# Altium project SMG_Clock_Project.PrjPcb
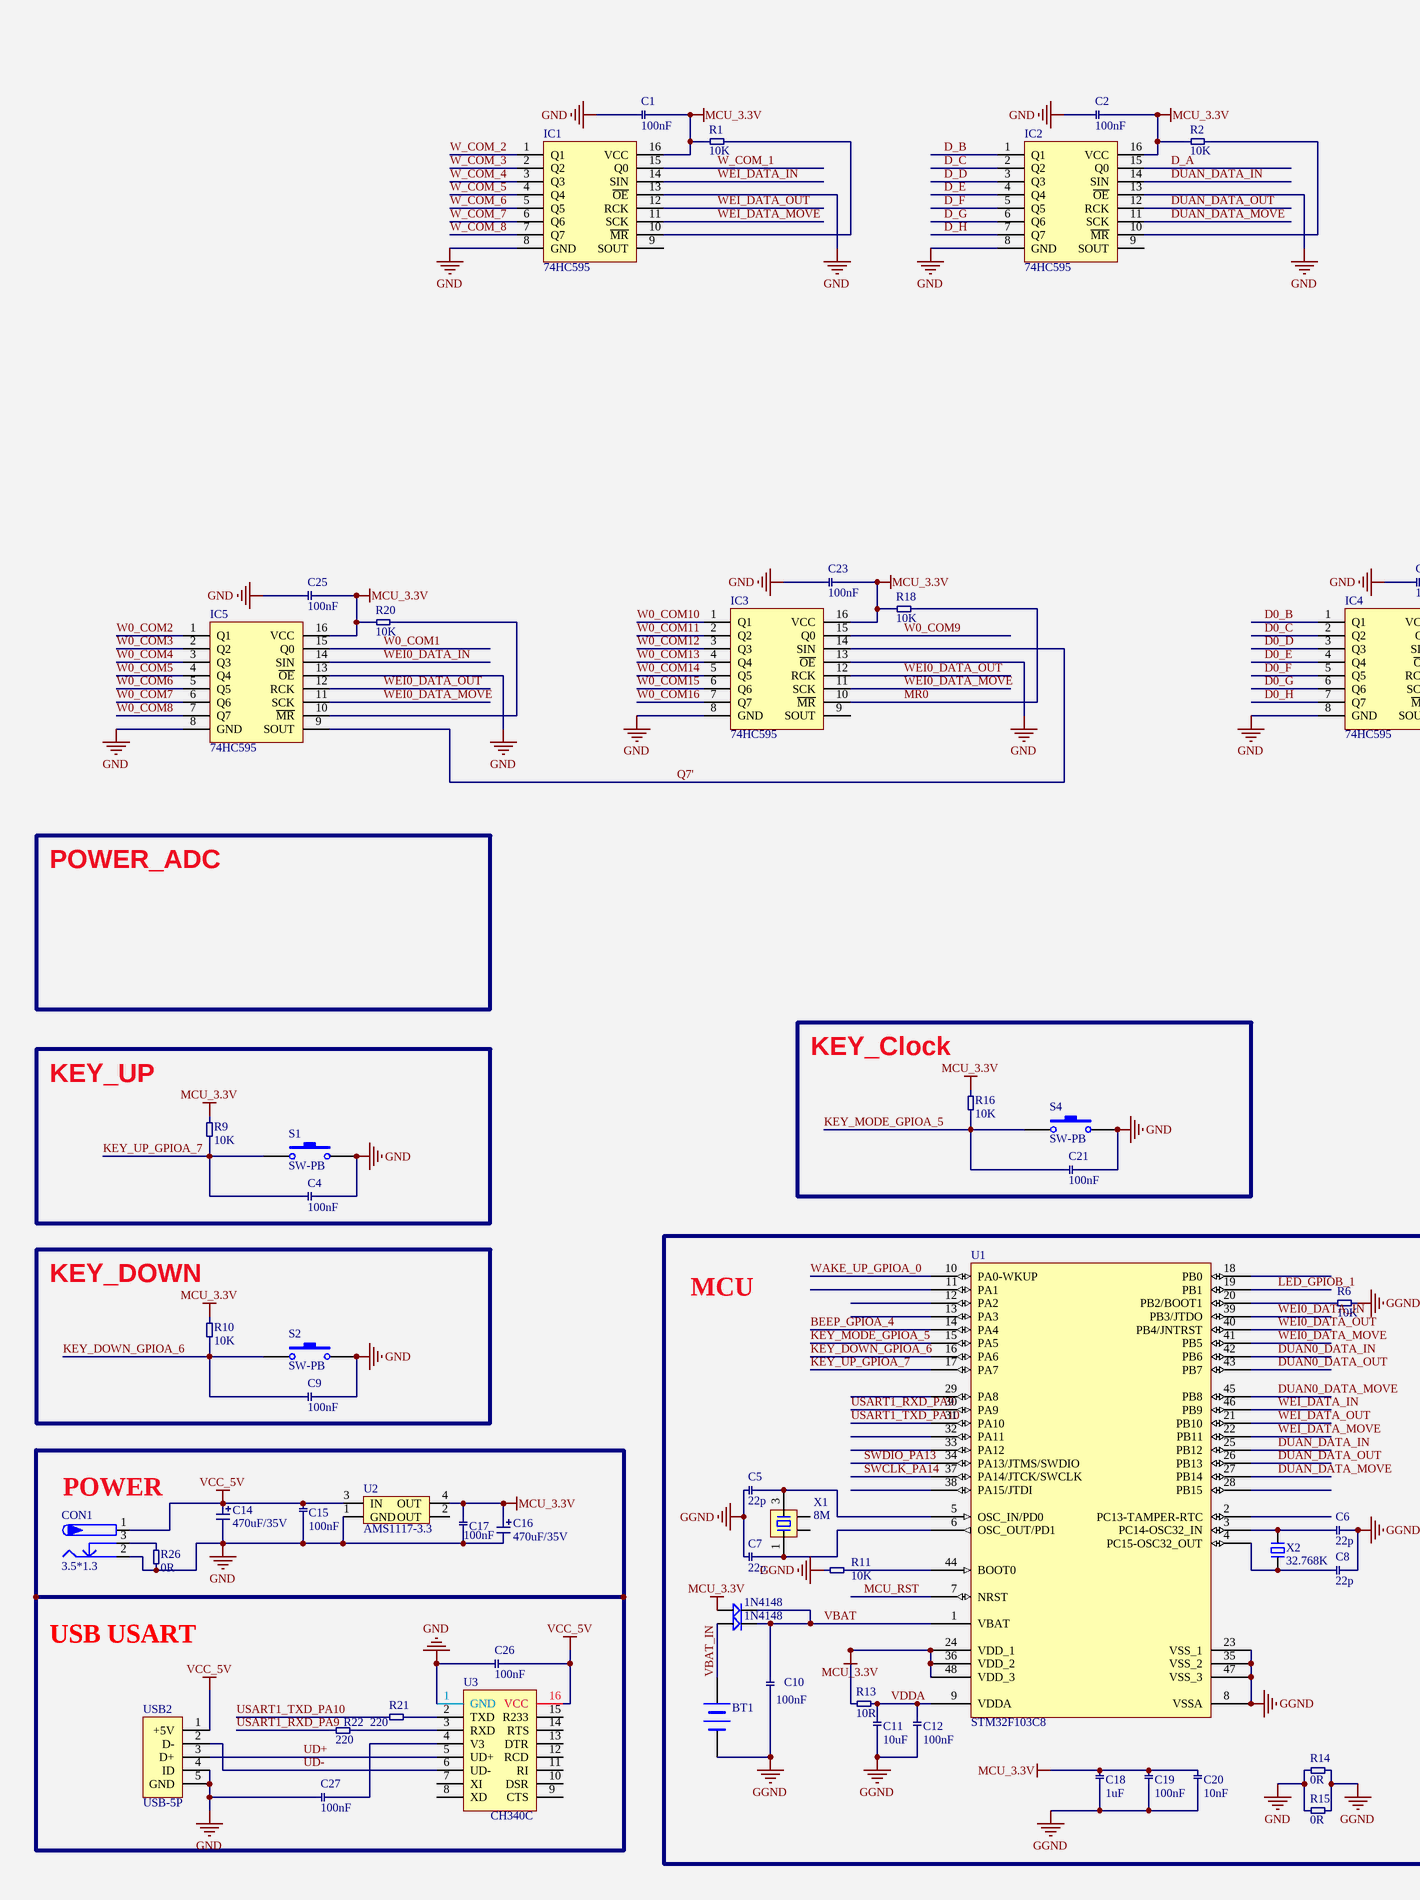
[diagram p0: Clock.SchDoc, left]
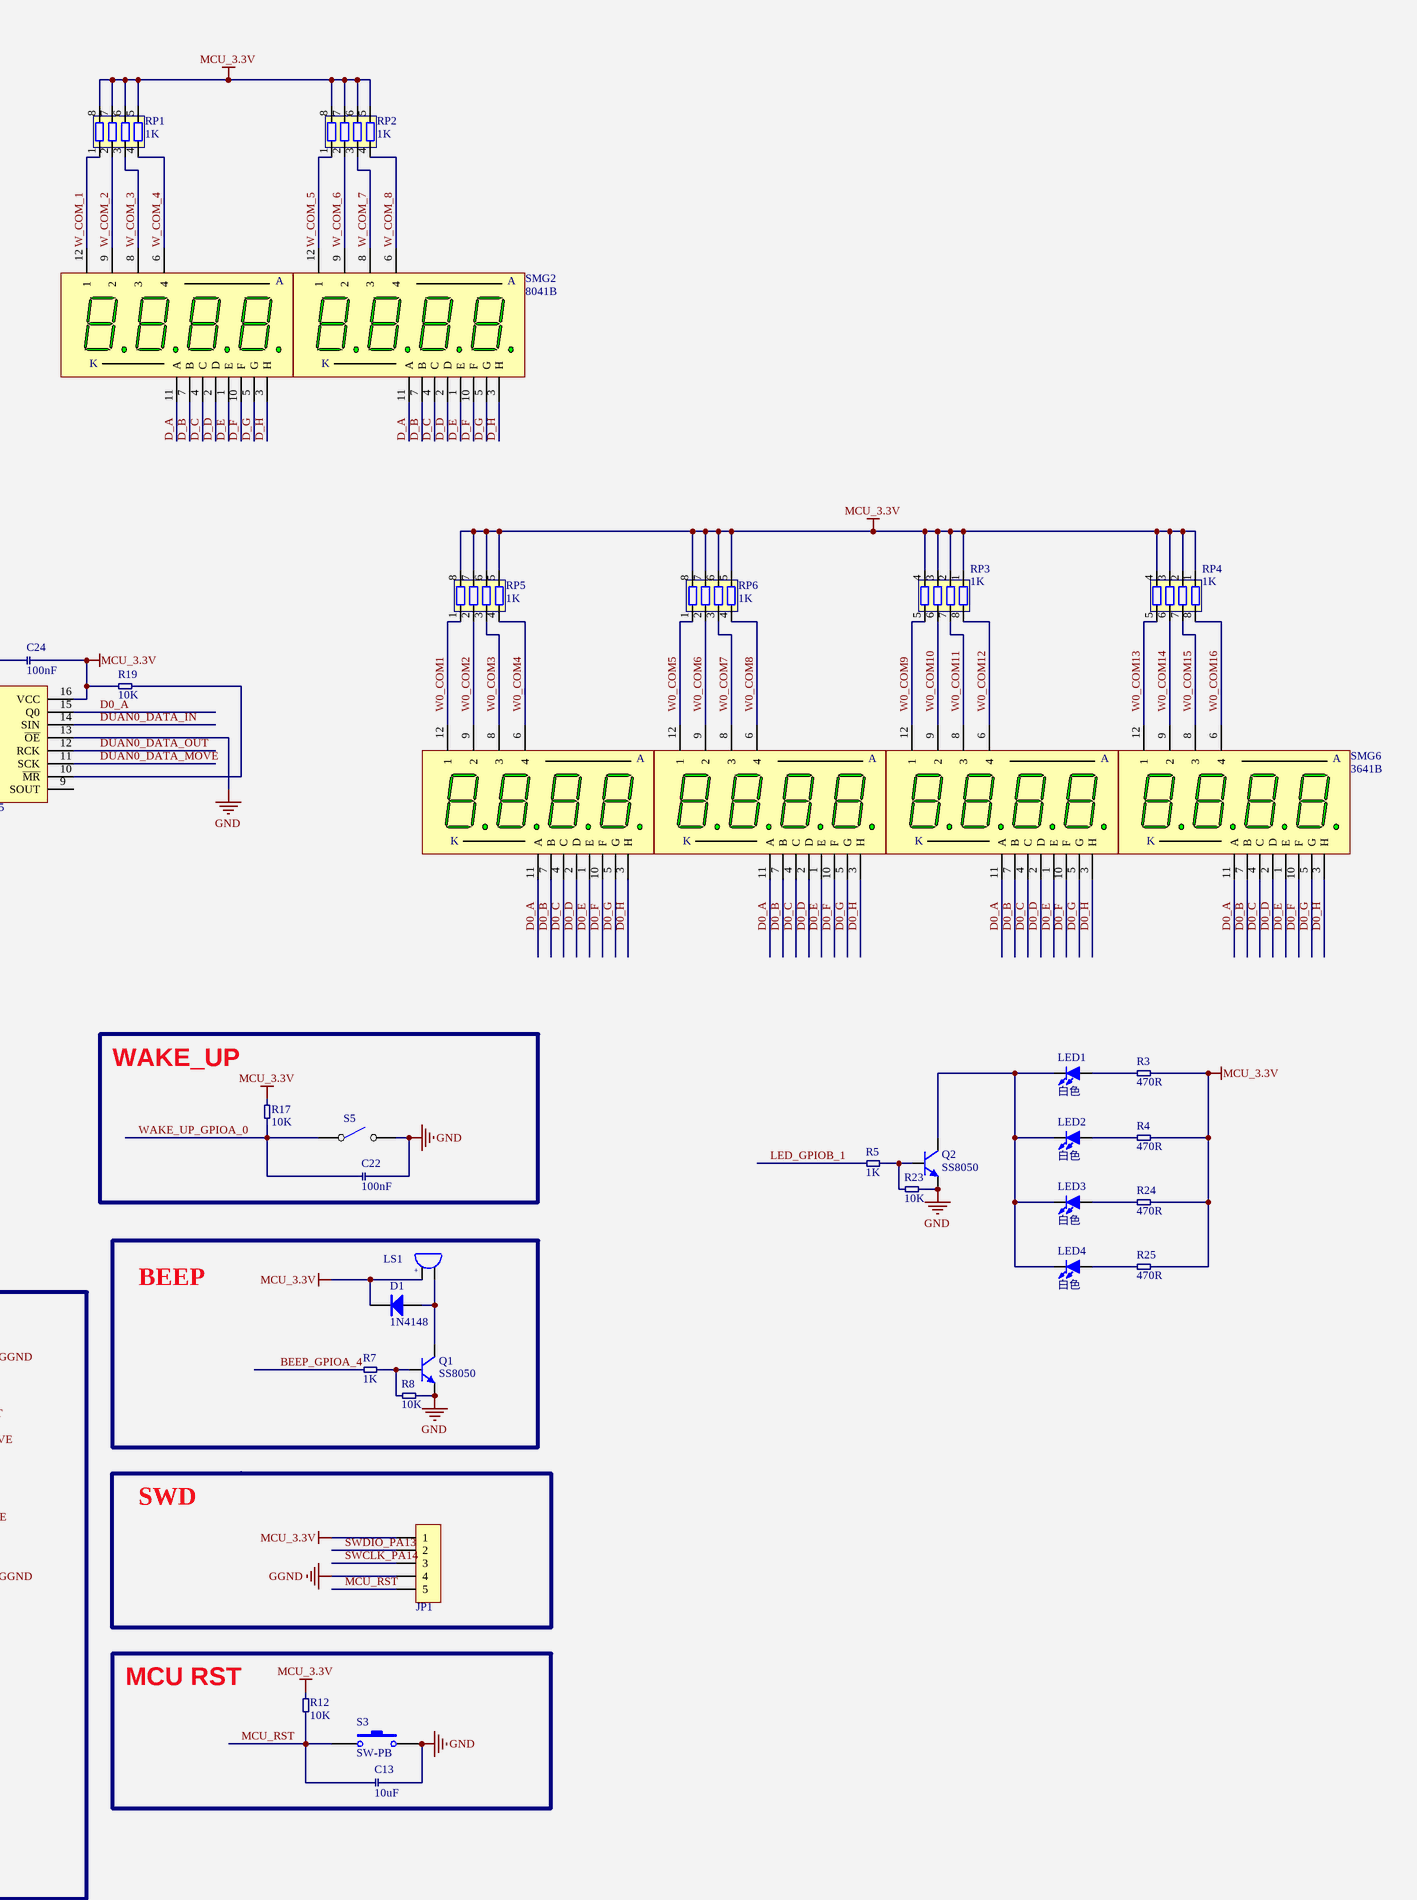
[diagram p1: Clock.SchDoc, right]
1 sheet, 93 parts. Net scope: global (net labels, ports and power ports of the same name join across sheets).
Board file: Clock_Board.PcbDoc

## Sheet Clock.SchDoc
size A2

### Parts
BT1  BATTERY  [VBAT]  (value not drawn)
C1  100nF  [0603CC]
C2  100nF  [0603CC]
C4  100nF  [0603CC]
C5  22p  [0603CC]
C6  22p  [0603CC]
C7  22p  [0603CC]
C8  22p  [0603CC]
C9  100nF  [0603CC]
C10  100nF  [0603CC]
C11  10uF  [0603CC]
C12  100nF  [0603CC]
C13  10uF  [0603CC]
C14  470uF/35V  [CD A(3216)]
C15  100nF  [0603CC]
C16  470uF/35V  [C3216]
C17  100nF  [0603CC]
C18  1uF  [0603CC]
C19  100nF  [0603CC]
C20  10nF  [0603CC]
C21  100nF  [0603CC]
C22  100nF  [0603CC]
C23  100nF  [0603CC]
C24  100nF  [0603CC]
C25  100nF  [0603CC]
C26  100nF  [0603CC]
C27  100nF  [0603CC]
CON1  3.5*1.3  [DC-012]
D1  1N4148  [SOD-323]
D2  1N4148  [SOD-323]
D4  1N4148  [SOD-323]
IC1  74HC595  [SOP16_N]
IC2  74HC595  [SOP16_N]
IC3  74HC595  [SOP16_N]
IC4  74HC595  [SOP16_N]
IC5  74HC595  [SOP16_N]
JP1  HDR-1X5  [HDR2.54-LI-5P]  (value not drawn)
LED1  白色  [LED 5MM-W]
LED2  白色  [LED 5MM-W]
LED3  白色  [LED 5MM-W]
LED4  白色  [LED 5MM-W]
LS1  DC5V  [BEEP 5x9x5.5]  (value not drawn)
Q1  SS8050  [SOT23-3N]
Q2  SS8050  [SOT23-3N]
R1  10K  [0603RR]
R2  10K  [0603RR]
R3  470R  [0603RR]
R4  470R  [0603RR]
R5  1K  [0603RR]
R6  10K  [0603RR]
R7  1K  [0603RR]
R8  10K  [0603RR]
R9  10K  [0603RR]
R10  10K  [0603RR]
R11  10K  [0603RR]
R12  10K  [0603RR]
R13  10R  [0603RR]
R14  0R  [0603RR]
R15  0R  [0603RR]
R16  10K  [0603RR]
R17  10K  [0603RR]
R18  10K  [0603RR]
R19  10K  [0603RR]
R20  10K  [0603RR]
R21  220  [0603RR]
R22  220  [0603RR]
R23  10K  [0603RR]
R24  470R  [0603RR]
R25  470R  [0603RR]
R26  0R  [0603RR]
RP1  1K  [RCA-8P4R-0603]
RP2  1K  [RCA-8P4R-0603]
RP3  1K  [RCA-8P4R-0603]
RP4  1K  [RCA-8P4R-0603]
RP5  1K  [RCA-8P4R-0603]
RP6  1K  [RCA-8P4R-0603]
S1  SW-PB  [TSW DIP-6*6*6_V]
S2  SW-PB  [TSW DIP-6*6*6_V]
S3  SW-PB  [TSW DIP-6*6*6_V]
S4  SW-PB  [TSW DIP-6*6*6_V]
S5  单刀开关  [CAP 2.5*5*11-H]  (value not drawn)
SMG1  8041B  [SMG 0.8-4P]
SMG2  8041B  [SMG 0.8-4P]
SMG3  3641B  [SMG 0.36-4P]
SMG4  3641B  [SMG 0.36-4P]
SMG5  3641B  [SMG 0.36-4P]
SMG6  3641B  [SMG 0.36-4P]
U1  STM32F103C8  [LQFP48 7X7_M]
U2  AMS1117-3.3  [SOT223_N]
U3  CH340C  [SOP16_L]
USB2  USB-5P  [USB-MICRO_C]
X1  8M  [OSC 3225-4P]
X2  32.768K  [OSC 3215-2P]

### Nets
GGND: BT1.2(-) C5.1 C6.2 C7.1 C8.2 C10.1 C11.1 C12.1 C18.1 C19.1 C20.1 JP1.4 R6.2 R11.1 R14.2 R15.2 U1.8(VSSA) U1.23(VSS_1) U1.35(VSS_2) U1.47(VSS_3)
GND: C1.2 C2.2 C4.2 C9.2 C13.1 C14.2 C15.1 C16.2 C17.1 C21.2 C22.2 C23.2 C24.2 C25.2 C26.2 C27.2 CON1.2 IC1.8(GND) IC1.13(~{OE}) IC2.8(GND) IC2.13(~{OE}) IC3.8(GND) IC3.13(~{OE}) IC4.8(GND) IC4.13(~{OE}) IC5.8(GND) IC5.13(~{OE}) Q1.2(E) Q2.2(E) R8.2 R14.1 R15.1 R23.2 R26.2 S1.2 S2.2 S3.2 S4.2 S5.2 U2.1(GND) U3.1(GND) USB2.4(ID) USB2.5(GND)
MCU_3.3V: C1.1 C2.1 C16.1 C17.2 C18.2 C19.2 C20.2 C23.1 C24.1 C25.1 D1.2(K) D4.1 IC1.16(VCC) IC2.16(VCC) IC3.16(VCC) IC4.16(VCC) IC5.16(VCC) JP1.1 LS1.1 R1.2 R2.2 R3.2 R4.2 R9.2 R10.2 R12.2 R13.1 R16.2 R17.2 R18.2 R19.2 R20.2 R24.2 R25.2 RP1.5 RP1.6 RP1.7 RP1.8 RP2.5 RP2.6 RP2.7 RP2.8 RP3.1 RP3.2 RP3.3 RP3.4 RP4.1 RP4.2 RP4.3 RP4.4 RP5.5 RP5.6 RP5.7 RP5.8 RP6.5 RP6.6 RP6.7 RP6.8 U1.24(VDD_1) U1.36(VDD_2) U1.48(VDD_3) U2.4(OUT)
VCC_5V: C14.1 C15.2 C26.1 CON1.1 U2.3(IN) U3.16(VCC) USB2.1(+5V)
BEEP_GPIOA_4: R7.1 U1.14(PA4)
D0_A: IC4.15(Q0) SMG3.11(A) SMG4.11(A) SMG5.11(A) SMG6.11(A)
D0_B: IC4.1(Q1) SMG3.7(B) SMG4.7(B) SMG5.7(B) SMG6.7(B)
D0_C: IC4.2(Q2) SMG3.4(C) SMG4.4(C) SMG5.4(C) SMG6.4(C)
D0_D: IC4.3(Q3) SMG3.2(D) SMG4.2(D) SMG5.2(D) SMG6.2(D)
D0_E: IC4.4(Q4) SMG3.1(E) SMG4.1(E) SMG5.1(E) SMG6.1(E)
D0_F: IC4.5(Q5) SMG3.10(F) SMG4.10(F) SMG5.10(F) SMG6.10(F)
D0_G: IC4.6(Q6) SMG3.5(G) SMG4.5(G) SMG5.5(G) SMG6.5(G)
D0_H: IC4.7(Q7) SMG3.3(H) SMG4.3(H) SMG5.3(H) SMG6.3(H)
D_A: IC2.15(Q0) SMG1.11(A) SMG2.11(A)
D_B: IC2.1(Q1) SMG1.7(B) SMG2.7(B)
D_C: IC2.2(Q2) SMG1.4(C) SMG2.4(C)
D_D: IC2.3(Q3) SMG1.2(D) SMG2.2(D)
D_E: IC2.4(Q4) SMG1.1(E) SMG2.1(E)
D_F: IC2.5(Q5) SMG1.10(F) SMG2.10(F)
D_G: IC2.6(Q6) SMG1.5(G) SMG2.5(G)
D_H: IC2.7(Q7) SMG1.3(H) SMG2.3(H)
DUAN0_DATA_IN: IC4.14(SIN) U1.42(PB6)
DUAN0_DATA_MOVE: IC4.11(SCK) U1.45(PB8)
DUAN0_DATA_OUT: IC4.12(RCK) U1.43(PB7)
DUAN_DATA_IN: IC2.14(SIN) U1.25(PB12)
DUAN_DATA_MOVE: IC2.11(SCK) U1.27(PB14)
DUAN_DATA_OUT: IC2.12(RCK) U1.26(PB13)
KEY_DOWN_GPIOA_6: C9.1 R10.1 S2.1 U1.16(PA6)
KEY_MODE_GPIOA_5: C21.1 R16.1 S4.1 U1.15(PA5)
KEY_UP_GPIOA_7: C4.1 R9.1 S1.1 U1.17(PA7)
LED_GPIOB_1: R5.1 U1.19(PB1)
MCU_RST: C13.2 JP1.5 R12.1 S3.1 U1.7(NRST)
MR0: IC3.10(~{MR}) R18.1
Q7': IC3.14(SIN) IC5.9(SOUT)
SWCLK_PA14: JP1.3 U1.37(PA14/JTCK/SWCLK)
SWDIO_PA13: JP1.2 U1.34(PA13/JTMS/SWDIO)
UD+: U3.5(UD+) USB2.3(D+)
UD-: U3.6(UD-) USB2.2(D-)
USART1_RXD_PA9: R22.1 U1.30(PA9)
USART1_TXD_PA10: R21.1 U1.31(PA10)
VBAT: C10.2 D2.2 D4.2 U1.1(VBAT)
VBAT_IN: BT1.1(+) D2.1
VDDA: C11.2 C12.2 R13.2 U1.9(VDDA)
W0_COM1: IC5.15(Q0) RP5.1 SMG3.12(1)
W0_COM2: IC5.1(Q1) RP5.2 SMG3.9(2)
W0_COM3: IC5.2(Q2) RP5.3 SMG3.8(3)
W0_COM4: IC5.3(Q3) RP5.4 SMG3.6(4)
W0_COM5: IC5.4(Q4) RP6.1 SMG4.12(1)
W0_COM6: IC5.5(Q5) RP6.2 SMG4.9(2)
W0_COM7: IC5.6(Q6) RP6.3 SMG4.8(3)
W0_COM8: IC5.7(Q7) RP6.4 SMG4.6(4)
W0_COM9: IC3.15(Q0) RP3.5 SMG5.12(1)
W0_COM10: IC3.1(Q1) RP3.6 SMG5.9(2)
W0_COM11: IC3.2(Q2) RP3.7 SMG5.8(3)
W0_COM12: IC3.3(Q3) RP3.8 SMG5.6(4)
W0_COM13: IC3.4(Q4) RP4.5 SMG6.12(1)
W0_COM14: IC3.5(Q5) RP4.6 SMG6.9(2)
W0_COM15: IC3.6(Q6) RP4.7 SMG6.8(3)
W0_COM16: IC3.7(Q7) RP4.8 SMG6.6(4)
W_COM_1: IC1.15(Q0) RP1.1 SMG1.12(1)
W_COM_2: IC1.1(Q1) RP1.2 SMG1.9(2)
W_COM_3: IC1.2(Q2) RP1.3 SMG1.8(3)
W_COM_4: IC1.3(Q3) RP1.4 SMG1.6(4)
W_COM_5: IC1.4(Q4) RP2.1 SMG2.12(1)
W_COM_6: IC1.5(Q5) RP2.2 SMG2.9(2)
W_COM_7: IC1.6(Q6) RP2.3 SMG2.8(3)
W_COM_8: IC1.7(Q7) RP2.4 SMG2.6(4)
WAKE_UP_GPIOA_0: C22.1 R17.1 S5.1 U1.10(PA0-WKUP)
WEI0_DATA_IN: IC5.14(SIN) U1.39(PB3/JTDO)
WEI0_DATA_MOVE: IC3.11(SCK) IC5.11(SCK) U1.41(PB5)
WEI0_DATA_OUT: IC3.12(RCK) IC5.12(RCK) U1.40(PB4/JNTRST)
WEI_DATA_IN: IC1.14(SIN) U1.46(PB9)
WEI_DATA_MOVE: IC1.11(SCK) U1.22(PB11)
WEI_DATA_OUT: IC1.12(RCK) U1.21(PB10)
NetC5_2: C5.2 U1.5(OSC_IN/PD0) X1.3
NetC6_1: C6.1 U1.3(PC14-OSC32_IN) X2.2
NetC7_2: C7.2 U1.6(OSC_OUT/PD1) X1.1
NetC8_1: C8.1 U1.4(PC15-OSC32_OUT) X2.1
NetC27_1: C27.1 U3.4(V3)
NetCON1_3: CON1.3 R26.1
NetD1_1: D1.1(A) LS1.2 Q1.3(C)
NetIC1_10: IC1.10(~{MR}) R1.1
NetIC2_10: IC2.10(~{MR}) R2.1
NetIC4_10: IC4.10(~{MR}) R19.1
NetIC5_10: IC5.10(~{MR}) R20.1
NetLED1_1: LED1.1(A) R3.1
NetLED1_2: LED1.2(K) LED2.2(K) LED3.2(K) LED4.2(K) Q2.3(C)
NetLED2_1: LED2.1(A) R4.1
NetLED3_1: LED3.1(A) R24.1
NetLED4_1: LED4.1(A) R25.1
NetQ1_1: Q1.1(B) R7.2 R8.1
NetQ2_1: Q2.1(B) R5.2 R23.1
NetR6_1: R6.1 U1.20(PB2/BOOT1)
NetR11_2: R11.2 U1.44(BOOT0)
NetR21_2: R21.2 U3.2(TXD)
NetR22_2: R22.2 U3.3(RXD)

Not connected (* = marked no-connect by the designer): IC1 9(SOUT); IC2 9(SOUT); IC3 9(SOUT); IC4 9(SOUT); U1 2(PC13-TAMPER-RTC) 11(PA1) 12(PA2) 13(PA3) 18(PB0) 28(PB15) 29(PA8) 32(PA11) 33(PA12) 38(PA15/JTDI); U2 2(OUT); U3 7(XI) 8(XD) 9(CTS) 10(DSR) 11(RI) 12(RCD) 13(DTR) 14(RTS) 15(R233); X1 2 4

### Notes on the sheet
- POWER_ADC
- WAKE_UP
- KEY_UP
- (near R16) KEY_Clock
- BEEP
- KEY_DOWN
- MCU
- (near CON1) POWER
- SWD
- USB USART
- MCU RST
- (in symbol 3641B) K
- (in symbol 8041B) K
- (in symbol BEEP) +

### Library data of the parts
C1 C2 C4-C13 C15 C17-C27 = cap
C14 C16 = Ecap
CON1 = P-DC: 低压电源接口; BOM名称: DC电源接口; 版权归属: 源创客; 学习资源: www.ooocke.com
D1 = 1N4148: 高速开关二极管; 版权归属: 源创客; BOM名称: 高速开关二极管; 学习资源: www.ooocke.com
D2 D4 = D
IC1-IC5 = 74HC595: 8位移位寄存器; 版权归属: 源创客; BOM名称: 8位移位寄存器; 学习资源: www.ooocke.com
JP1 = Header 5: 5P接插件; 版权归属: 源创客; BOM名称: 5P接插件; 学习资源: www.ooocke.com
LED1-LED4 = LED-5MM: 5mm插件LED; 版权归属: 源创客; BOM名称: 5mm插件LED; 学习资源: www.ooocke.com
LS1 = BEEP: 蜂鸣器; 版权归属: 源创客; BOM名称: 蜂鸣器; 学习资源: www.ooocke.com
Q1 Q2 = 8050-SMD: 高频放大-NPN型; 版权归属: 源创客; 属性: 40V 1.5A 1W 100MHZ; BOM名称: 高频放大-NPN型; 学习资源: www.ooocke.com
R1-R26 = res
RP1-RP6 = Resistor_Pack
S1-S4 = SW-PB: Switch; Published: 24-Mar-1999; LatestRevisionDate: 17-Jul-2002; LatestRevisionNote: Re-released for DXP Platform.; PackageReference: SPST-2; Publisher: Altium Limited
SMG1 SMG2 = 8041B: 0.8寸4位共阳数码管; 版权归属: 源创客; BOM名称: 0.8寸4位共阳; 学习资源: www.ooocke.com
SMG3-SMG6 = 3641B: 0.36寸4位共阳数码管; 版权归属: 源创客; BOM名称: 0.36寸4位共阳; 学习资源: www.ooocke.com
U1 = STM32F103C8: Flaah:64/RAM:20/IO:36; BOM名称: 32位STM单片机; 版权归属: 源创客; 学习资源: www.ooocke.com
U2 = AMS1117
USB2 = USB-5P: 微型USB母座; 版权归属: 源创客; BOM名称: 微型USB母座; 学习资源: www.ooocke.com
X1 = XTAL-4P: 4脚无源晶振; 版权归属: 源创客; BOM名称: 4脚无源晶振; 学习资源: www.ooocke.com
X2 = XTAL-2P: 2脚无源脚晶振; 版权归属: 源创客; BOM名称: 2脚无源脚晶振; 学习资源: www.ooocke.com